# EAGLE schematic Power Circuit (EAGLE 8.7.0)
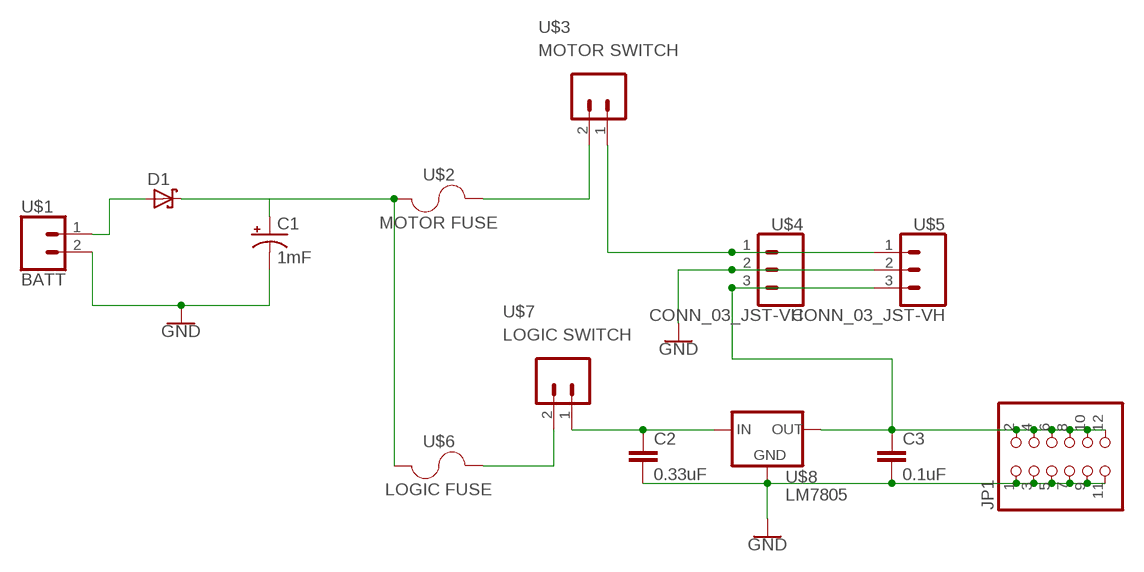
[diagram p0: schematic, sheet 1]

## Parts
C1  1mF  1000UF-RADIAL-5MM-25V-20%  [CPOL-RADIAL-5MM-10MM]
C2  0.33uF  C5/3  [C5B3]
C3  0.1uF  C5/3  [C5B3]
D1  SCHOTTKY-DIODEP6T15  [P6T15]
JP1  PINHD-2X6  [2X06]
U$1  BATT  CONN_02_JST-VH  [B2P-VH]
U$2  MOTOR FUSE  FUSE_MINI_BLADE  [SL-1538]
U$3  MOTOR SWITCH  CONN_02_JST-VH  [B2P-VH]
U$4  CONN_03_JST-VH  [B3P-VH]
U$5  CONN_03_JST-VH  [B3P-VH]
U$6  LOGIC FUSE  FUSE_MINI_BLADE  [SL-1538]
U$7  LOGIC SWITCH  CONN_02_JST-VH  [B2P-VH]
U$8  LM7805  [TO220-ADJ]

## Nets
GND: C1.- C2.2 C3.2 JP1.1 JP1.3 JP1.5 JP1.7 JP1.9 JP1.11 U$1.2 U$4.2 U$5.2 U$8.GND
N$1: D1.A U$1.1
N$2: C1.+ D1.C U$2.P$1 U$6.P$1
N$3: U$3.1 U$4.1 U$5.1
N$4: U$2.P$2 U$3.2
N$5: U$6.P$2 U$7.2
N$6: C2.1 U$7.1 U$8.INPUT(IN)
N$9: C3.1 JP1.2 JP1.4 JP1.6 JP1.8 JP1.10 JP1.12 U$4.3 U$5.3 U$8.OUTPUT(OUT)

## Library data of the parts
C1 = SparkFun-Capacitors:1000UF: 1,000µF/1mF ceramic capacitors A capacitor is a passive two-terminal electrical component used to store electrical energy temporarily in an electric field. CAP-08070; PROD_ID: CAP-09538
C2 C3 = capacitor-wima:C: CAPACITOR naming: grid - package width
D1 = diode:SCHOTTKY-DIODE: Schottky Diode
JP1 = pinhead:PINHD-2X6: PIN HEADER
U$1 U$3 U$7 = JST-VH:CONN_02_JST-VH: B2P-VH(LF)(SN) Digikey <https://www.digikey.com.au/product-detail/en/jst-sales-america-inc/B2P-VH-LF-SN/455-1639-ND/926547>
U$2 U$6 = Fuse_Holder:FUSE_MINI_BLADE: SL-1538 Aliexpress <https://www.aliexpress.com/item/SL-1538-MINI-Style-Blade-Fuse-Holers-PCB-Mount-Fuse-holders-0153008/503553051.html>
U$4 U$5 = JST-VH:CONN_03_JST-VH: B3P-VH(LF)(SN) Digikey <https://www.digikey.com.au/products/en?keywords=455-1640-ND>
U$8 = LM7805:LM7805